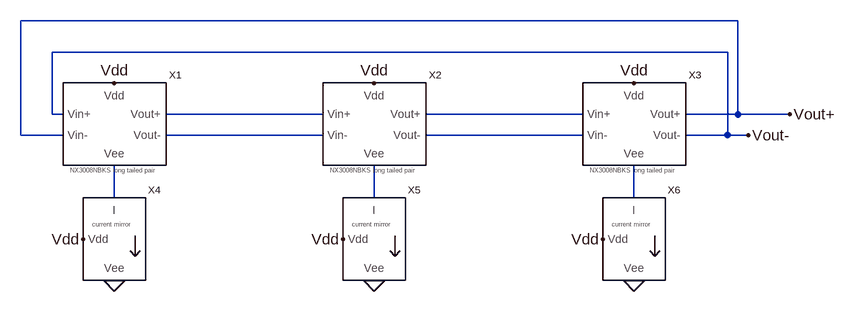
[diagram p0: schematic mosfet_differential_ring_oscillator_3stage.asc]
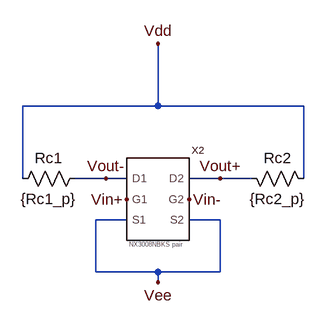
[diagram p1: sub-circuit mosfet_long_tailed_pair.asc]
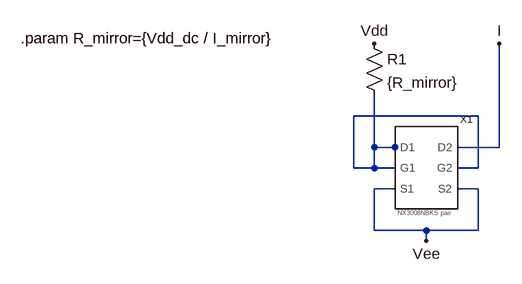
[diagram p2: sub-circuit current_mirror.asc]
mosfet_differential_ring_oscillator_3stage.asc, the LTspice schematic file:
Version 4.1
SHEET 1 1528 680
WIRE 1184 -48 80 -48
WIRE 1168 0 128 0
WIRE 128 96 128 0
WIRE 144 96 128 96
WIRE 544 96 304 96
WIRE 944 96 704 96
WIRE 1184 96 1184 -48
WIRE 1184 96 1104 96
WIRE 1264 96 1184 96
WIRE 80 128 80 -48
WIRE 144 128 80 128
WIRE 544 128 304 128
WIRE 944 128 704 128
WIRE 1168 128 1168 0
WIRE 1168 128 1104 128
WIRE 1200 128 1168 128
WIRE 224 224 224 176
WIRE 624 224 624 176
WIRE 1024 224 1024 176
FLAG 224 48 Vdd
FLAG 624 48 Vdd
FLAG 1024 48 Vdd
FLAG 1264 96 Vout+
FLAG 1200 128 Vout-
FLAG 224 352 0
FLAG 624 352 0
FLAG 1024 352 0
FLAG 176 288 Vdd
FLAG 576 288 Vdd
FLAG 976 288 Vdd
SYMBOL mosfet_long_tailed_pair 224 112 R0
SYMATTR InstName X1
SYMBOL mosfet_long_tailed_pair 624 112 R0
SYMATTR InstName X2
SYMBOL mosfet_long_tailed_pair 1024 112 R0
SYMATTR InstName X3
SYMBOL current_mirror 224 256 R0
SYMATTR InstName X4
SYMBOL current_mirror 624 256 R0
SYMATTR InstName X5
SYMBOL current_mirror 1024 256 R0
SYMATTR InstName X6

mosfet_long_tailed_pair.asc, the sub-circuit schematic file:
Version 4.1
SHEET 1 1140 680
WIRE 208 32 208 -64
WIRE 208 32 0 32
WIRE 432 32 208 32
WIRE 0 144 0 32
WIRE 128 144 80 144
WIRE 160 144 128 144
WIRE 304 144 256 144
WIRE 352 144 304 144
WIRE 432 144 432 32
WIRE 160 208 112 208
WIRE 304 208 256 208
WIRE 112 288 112 208
WIRE 208 288 112 288
WIRE 304 288 304 208
WIRE 304 288 208 288
WIRE 208 304 208 288
FLAG 208 -64 Vdd
FLAG 160 176 Vin+
FLAG 256 176 Vin-
FLAG 208 304 Vee
FLAG 128 144 Vout-
FLAG 304 144 Vout+
SYMBOL res 96 128 R90
WINDOW 0 0 56 VBottom 2
WINDOW 3 32 56 VTop 2
SYMATTR InstName Rc1
SYMATTR Value {Rc1_p}
SYMBOL res 336 128 M90
WINDOW 0 0 56 VBottom 2
WINDOW 3 32 56 VTop 2
SYMATTR InstName Rc2
SYMATTR Value {Rc2_p}
SYMBOL NX3008NBKS_pair 224 176 R0
SYMATTR InstName X2

current_mirror.asc, the sub-circuit schematic file:
Version 4.1
SHEET 1 1140 680
WIRE 288 96 96 96
WIRE 128 144 128 64
WIRE 160 144 160 128
WIRE 160 144 128 144
WIRE 320 144 320 -16
WIRE 320 144 256 144
WIRE 96 176 96 96
WIRE 128 176 128 144
WIRE 128 176 96 176
WIRE 160 176 128 176
WIRE 288 176 288 96
WIRE 288 176 256 176
WIRE 160 208 128 208
WIRE 288 208 256 208
WIRE 128 272 128 208
WIRE 208 272 128 272
WIRE 288 272 288 208
WIRE 288 272 208 272
WIRE 208 288 208 272
FLAG 320 -16 I
FLAG 208 288 Vee
FLAG 128 -16 Vdd
SYMBOL res 112 -32 R0
SYMATTR InstName R1
SYMATTR Value {R_mirror}
SYMBOL NX3008NBKS_pair 224 176 R0
SYMATTR InstName X1
TEXT -416 -24 Left 2 !.param R_mirror={Vdd_dc / I_mirror}

The netlist it stands for:
* mosfet_differential_ring_oscillator_3stage.asc
X§X1 Vdd Vout- Vout+ N005 N001 N003 mosfet_long_tailed_pair
X§X2 Vdd N001 N003 N006 N002 N004 mosfet_long_tailed_pair
X§X3 Vdd N002 N004 N007 Vout+ Vout- mosfet_long_tailed_pair
X§X4 Vdd 0 N005 current_mirror
X§X5 Vdd 0 N006 current_mirror
X§X6 Vdd 0 N007 current_mirror

* block symbol definitions
.subckt mosfet_long_tailed_pair Vdd Vin+ Vin- Vee Vout+ Vout-
Rc1 Vout- Vdd {Rc1_p}
Rc2 Vout+ Vdd {Rc2_p}
X§X2 Vout- Vin+ Vee Vout+ Vin- Vee NX3008NBKS_pair  ; pins D1 G1 S1 D2 G2 S2
.ends mosfet_long_tailed_pair

.subckt current_mirror Vdd Vee I
R1 Vdd N001 {R_mirror}
X§X1 N001 N001 Vee I N001 Vee NX3008NBKS_pair  ; pins D1 G1 S1 D2 G2 S2
.param R_mirror={Vdd_dc / I_mirror}
.ends current_mirror

.backanno
.end